# EAGLE design MPU9250 Adapter (EAGLE 8.7.0)
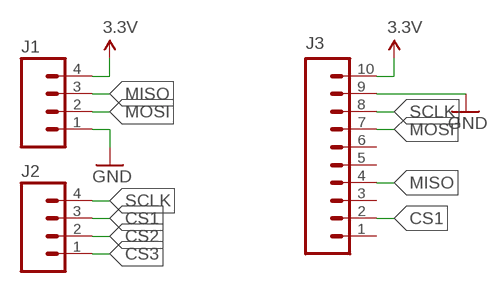
[diagram p0: schematic, sheet 1]

## Parts
J1  M04PTH  [1X04]
J2  M04PTH  [1X04]
J3  M10SILK_FEMALE_PTH  [1X10]

## Nets
3.3V: J1.4 J3.10
CS1: J2.3 J3.2
CS2: J2.2
CS3: J2.1
GND: J1.1 J3.9
MISO: J1.3 J3.4
MOSI: J1.2 J3.7
SCLK: J2.4 J3.8
Unconnected: J3.1 J3.3 J3.5 J3.6

## Library data of the parts
J1 J2 = SparkFun-Connectors:M04: Header 4 Standard 4-pin 0.1" header. Use with straight break away headers (SKU : PRT-00116), right angle break away headers (PRT-00553), swiss pins (PRT-00743), machine pins (PRT-00117), and female headers (PRT-00115). Molex polarized connector foot print use with SKU : PRT-08231 with associated crimp pins and housings. 1MM SMD Version SKU: PRT-10208; PROD_ID: CONN-09696
J3 = SparkFun-Connectors:M10: Header 10 Standard 10-pin 0.1" header. Use with straight break away headers (SKU : PRT-00116), right angle break away headers (PRT-00553), swiss pins (PRT-00743), machine pins (PRT-00117), and female headers (PRT-00115).; PROD_ID: CONN-11563

## Board
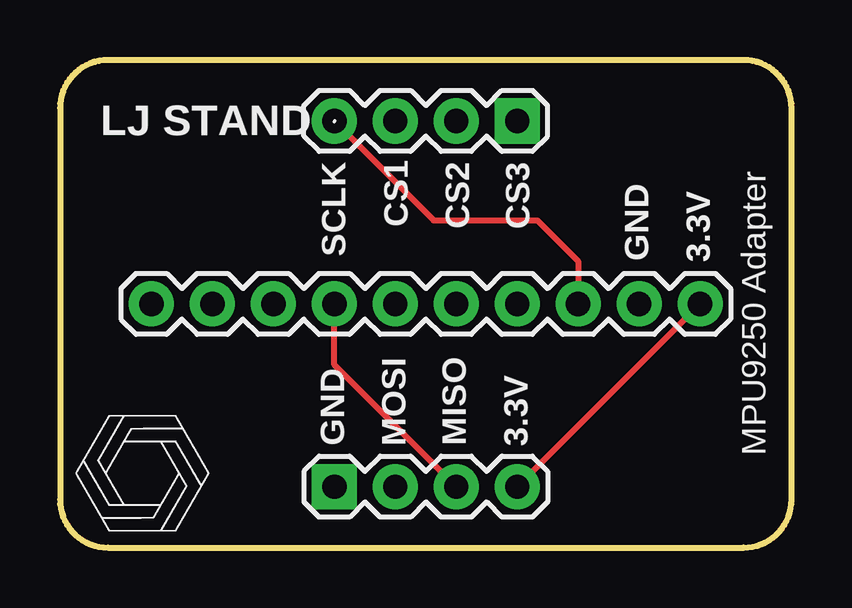
[diagram p1: board, top side]
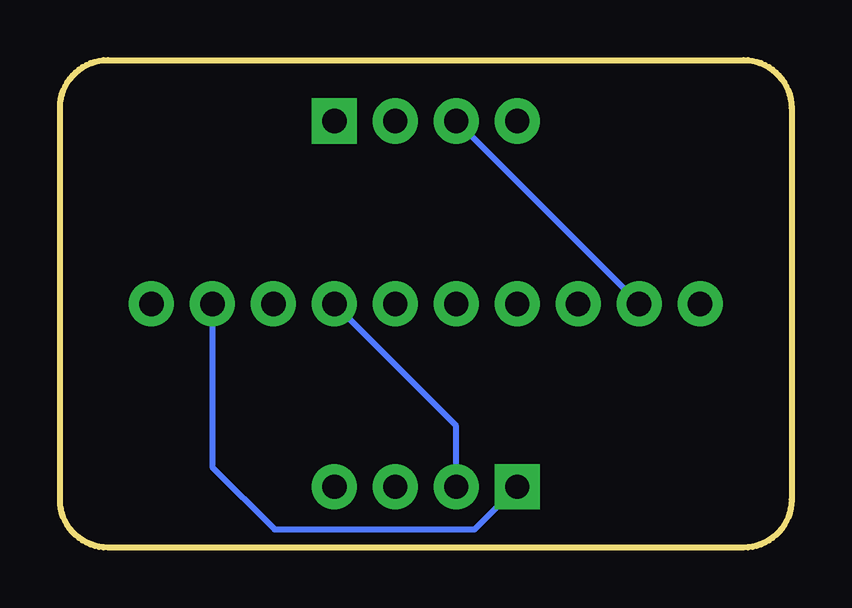
[diagram p2: board, bottom side, seen from below]

Size 30.48 x 20.32 mm. Coordinates in mm from the lower left corner, seen from the top.
Outline: 2,20.32 arc90 0,18.32 0,2 arc90 2,0 28.48,0 arc90 30.48,2 30.48,18.32 arc90 28.48,20.32 2,20.32
Copper layers (1*16): Top 0.035mm / dielectric 1.5mm / Bottom 0.035mm
Design rules "SparkFun": minimum track width 8mil, minimum drill 20mil, track to track 8mil, track to pad 8mil, pad to pad 8mil, via to via 8mil, smd to smd 8mil, copper to edge 10mil, drill to drill 8mil, minimum pad ring 12mil, minimum via ring 10mil, stop-mask expansion 4mil, vias tented up to drill 25mil, thermal gap 10mil

### Footprints (pad centres in the part's own frame; a part is rotated, then mirrored left to right if it is on the bottom)
1X04 = drill 1.016 pad 1.88 square: 1 0,0 | drill 1.016 pad 1.88: 2 2.54,0; 3 5.08,0; 4 7.62,0
1X10 = drill 1.016 pad 1.88: 1 0,0; 2 2.54,0; 3 5.08,0; 4 7.62,0; 5 10.16,0; 6 12.7,0; 7 15.24,0; 8 17.78,0; 9 20.32,0; 10 22.86,0

### Placement (x,y rotation side)
J1  11.43,2.54 0 top
J2  19.05,17.78 180 top
J3  3.81,10.16 0 top

### Tracks (layer width: path | path; a pad name or v marks a point on that pad's centre or on a via)
3.3V
  Top 0.254: J3.10 J1.4
CS1
  Bottom 0.254: J2.3 J3.2
GND
  Bottom 0.254: J3.9 24.13,3.35 21.54,0.76 13.21,0.76 J1.1
MISO
  Top 0.254: J1.3 11.43,7.62 J3.4
MOSI
  Bottom 0.254: J1.2 13.97,5.08 J3.7
SCLK
  Top 0.254: J2.4 15.57,13.64 19.89,13.64 21.59,11.94 J3.8

### Text on the board
tPlace: LJ STAND | SCLK | CS1 | CS2 | CS3 | GND | 3.3V | GND | MOSI | MISO | 3.3V | MPU9250 Adapter